# EasyEDA Pro project USB-HUB-V2.0.epro

# Schematic Schematic1
Board Name: Board1_1; Create Date: 2025-10-04; Page Name: P1; Project Name: USB扩展坞2.0; Schematic Name: Schematic1_1; Update Date: 2025-10-04; Company: 嘉立创EDA; Page Size: A4; Version: V1.0
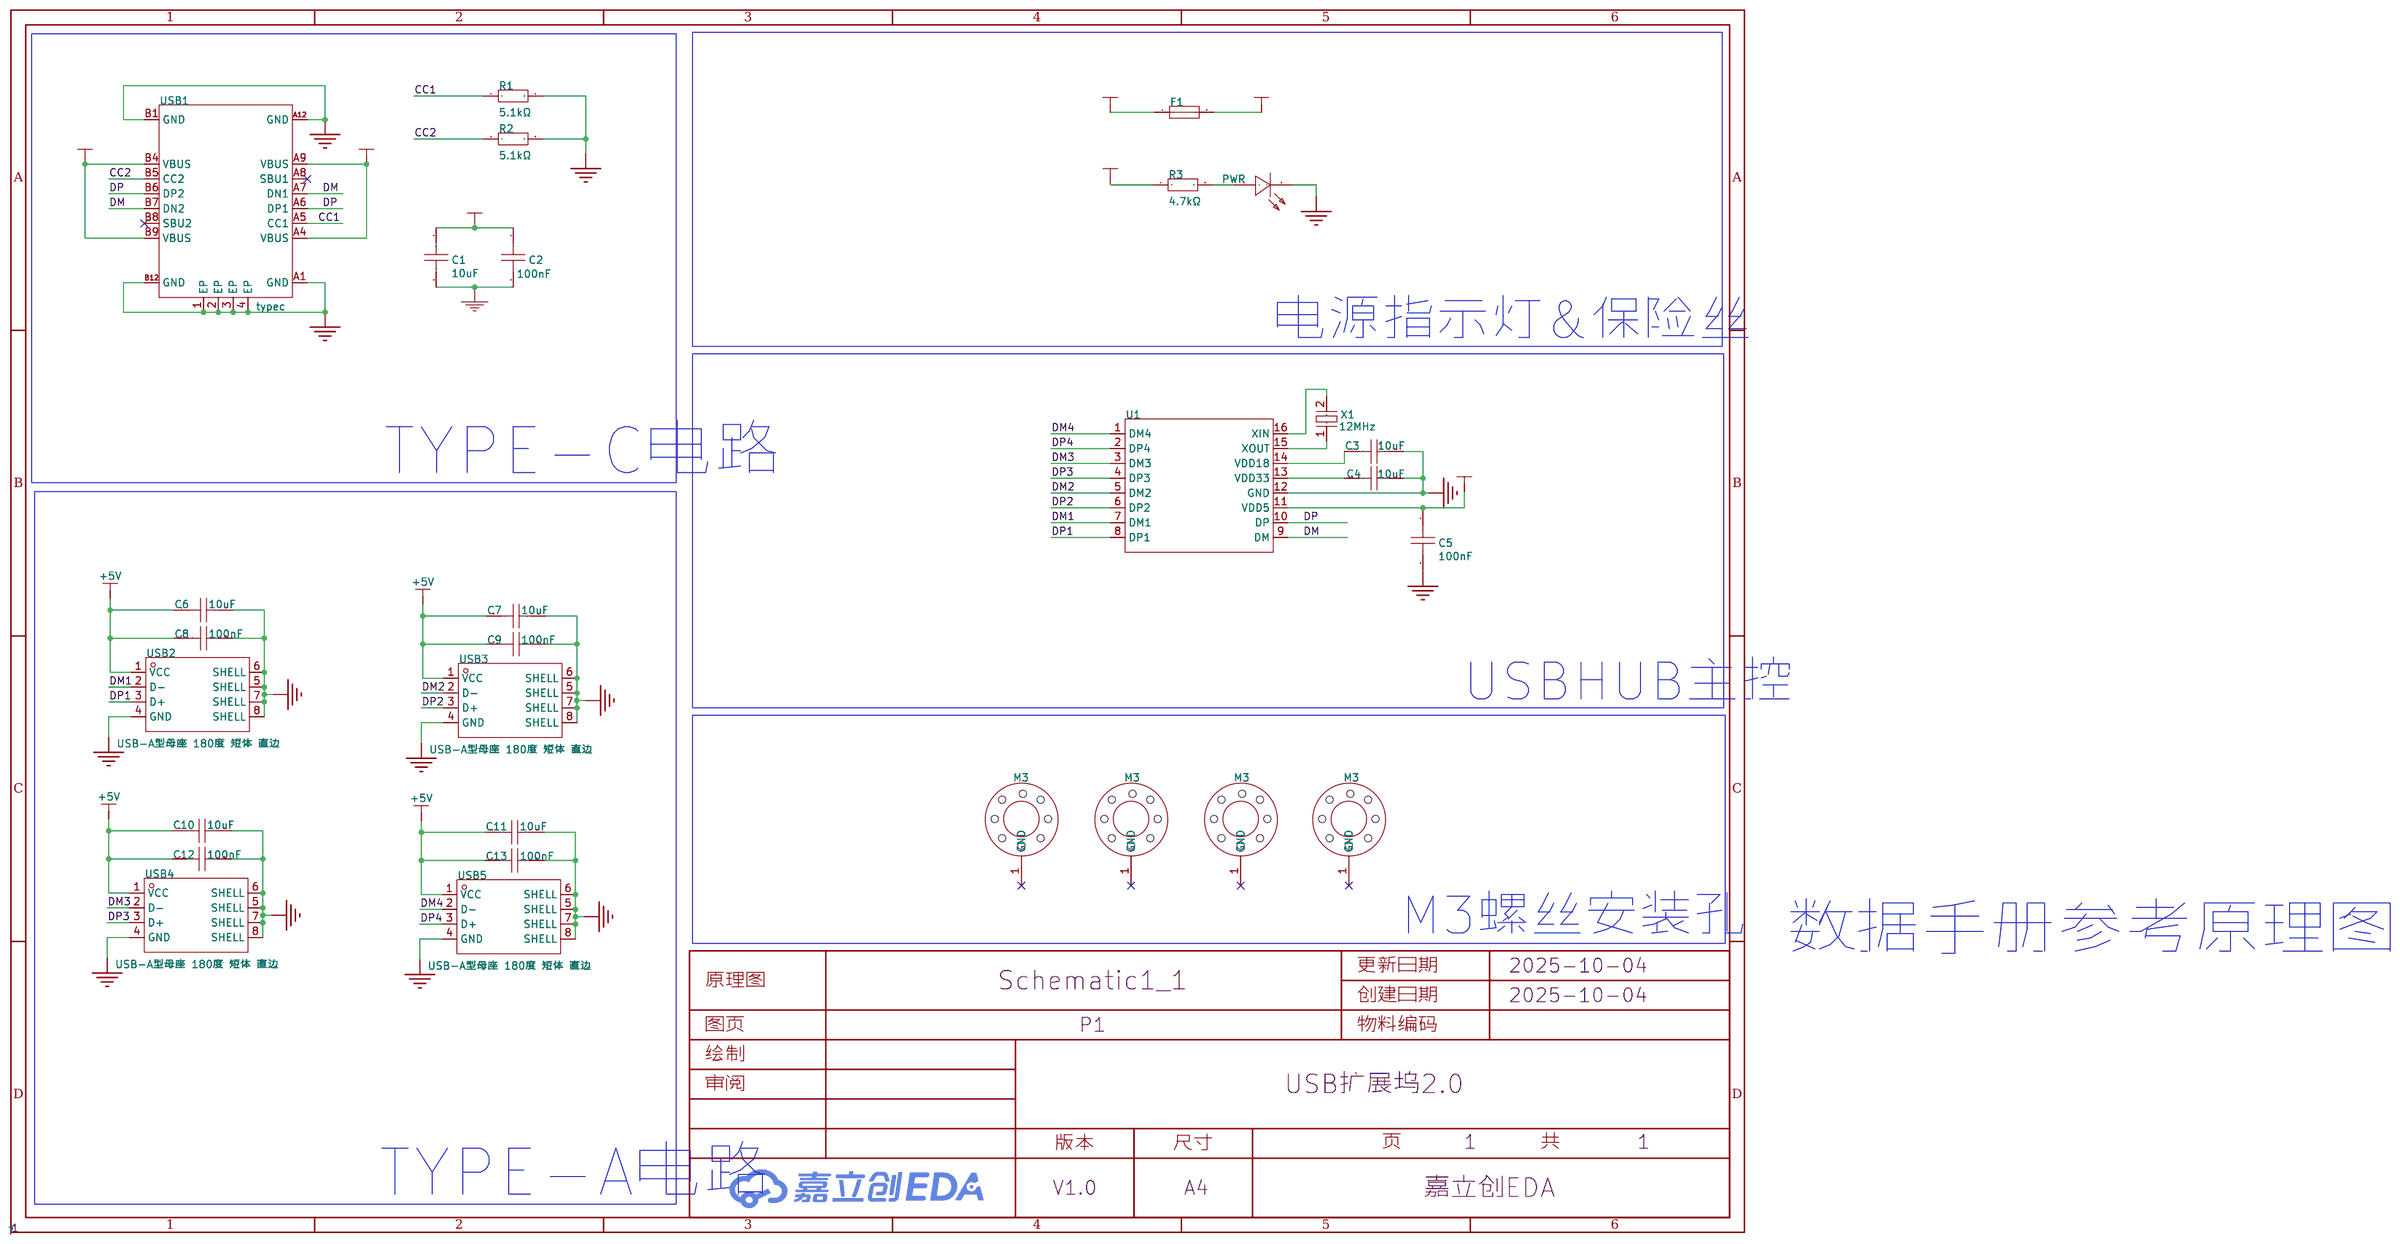
[diagram p0: schematic sheet]

## Parts
C1  10uF  [C0805]
C2  100nF  [C0805]
C3  10uF  [C0805]
C4  10uF  [C0805]
C5  100nF  [C0805]
C6  10uF  [C0805]
C7  10uF  [C0805]
C8  100nF  [C0805]
C9  100nF  [C0805]
C10  10uF  [C0805]
C11  10uF  [C0805]
C12  100nF  [C0805]
C13  100nF  [C0805]
F1  BSMD1206-150-12V  [F1206]
hole1  M3  [m3梅花孔]
hole2  M3  [m3梅花孔]
hole3  M3  [m3梅花孔]
hole4  M3  [m3梅花孔]
PWR  NCD0805R1  [LED0805-R-RD]
R1  5.1kΩ  [R0805]
R2  5.1kΩ  [R0805]
R3  4.7kΩ  [R0805]
U1  SL2.1A  [SOP-16_L10.0-W3.9-P1.27-LS6.0-BL]
USB1  typec  [USB-C-SMD_KH-TYPE-C-16P]
USB2  USB-A型母座 180度 短体 直边  [USB-A-SMD_WT_C9900004571]
USB3  USB-A型母座 180度 短体 直边  [USB-A-SMD_WT_C9900004571]
USB4  USB-A型母座 180度 短体 直边  [USB-A-SMD_WT_C9900004571]
USB5  USB-A型母座 180度 短体 直边  [USB-A-SMD_WT_C9900004571]
X1  12MHz  [CRYSTAL-SMD_L5.0-W3.2-1]

## Library data of the parts
C1 C6 C7 C10 C11 = CL21A106KOQNNNE: 容值:10uF;精度:±10%;额定电压:16V;温度系数:X5R;; LCSC Part Name: 10uF ±10% 16V; Supplier Part: C1713; Manufacturer: SAMSUNG(三星); Supplier Footprint: 0805; JLCPCB Part Class: Extended Part; Datasheet: https://item.szlcsc.com/datasheet/CL21A106KOQNNNE/2065.html; Supplier: LCSC; Tolerance: ±10%; Voltage Rating: 16V; Temperature Coefficient: X5R
C2 C5 C8 C9 C12 C13 = 0805B104K500NT: 容值:100nF;精度:±10%;额定电压:50V;温度系数:X7R;; LCSC Part Name: 100nF ±10% 50V; Supplier Part: C38141; Manufacturer: FH(风华); Supplier Footprint: 0805; JLCPCB Part Class: Extended Part; Datasheet: https://item.szlcsc.com/datasheet/0805B104K500NT/39123.html; Supplier: LCSC; Tolerance: ±10%; Voltage Rating: 50V; Temperature Coefficient: X7R
C3 C4 = CL21A106KBYQNNE: 容值:10uF;精度:±10%;额定电压:50V;温度系数:X5R;; LCSC Part Name: 10uF ±10% 50V; Supplier Part: C2932476; Manufacturer: SAMSUNG(三星); Supplier Footprint: 0805; JLCPCB Part Class: 扩展库; Datasheet: https://item.szlcsc.com/datasheet/CL21A106KBYQNNE/3277789.html; Supplier: LCSC; Tolerance: ±10%; Voltage Rating: 50V; Temperature Coefficient: X5R
F1 = BSMD1206-150-12V: 耐压(Vmax):12V;最大电流(Imax):40A;保持电流(Ihold):1.5A;跳闸电流(Itrip):3A;; LCSC Part Name: 12V 1.5A 1206自恢复; Supplier Part: C3020147; Manufacturer: BHFUSE(佰宏); Supplier Footprint: 1206; JLCPCB Part Class: 扩展库; Datasheet: https://item.szlcsc.com/datasheet/BSMD1206-150-12V/3539855.html; Supplier: LCSC; Voltage - Max: 12V; Current - Max: 40A; Hold Current: 1.5A; Trip Current: 3A; Power Dissipation: 800mW; Resistance - Initial (Ri) (Min): 25mΩ; Resistance - Post Trip (R1) (Max): 130mΩ; Operating Temperature: -40℃~+85℃
hole1-hole4 = m3_梅花螺丝孔: 梅花螺丝孔
PWR = NCD0805R1: 灯头类型:-;发光颜色:红色;正向电压(VF):1.6V~2.6V;功率:65mW;正向电流:20mA;主波长:615nm~630nm;二极管配置:独立二极管;透镜颜色:无色透明透镜;色温:-;发光强度:67mcd~195mcd;发光角度:130°;载带方式:-;工作温度:-30℃~+85℃;; Supplier Part: C84256; Manufacturer: 国星光电; Supplier Footprint: 0805; JLCPCB Part Class: 基础库; Datasheet: https://atta.szlcsc.com/upload/public/pdf/source/20200820/C84256_F0A75A43B3EAD75808600A0514C76B99.pdf; Supplier: LCSC; Emitted Color: 红色; Forward Voltage (VF): 1.6V~2.6V; Power Dissipation: 65mW; Forward Current: 20mA; Dominant Wavelength: 615nm~630nm; Diode Configuration: 独立二极管; Lens Color: 无色透明透镜; Luminous Intensity: 67mcd~195mcd; Viewing Angle: 130°; Operating Temperature: -30℃~+85℃
R1 R2 = 0805W8F5101T5E: 电阻类型:厚膜电阻;阻值:5.1kΩ;精度:±1%;功率:125mW;工作电压:150V;温度系数:±100ppm/℃;; LCSC Part Name: 5.1kΩ ±1% 125mW 厚膜电阻; Supplier Part: C27834; Manufacturer: UNI-ROYAL(厚声); Supplier Footprint: 0805; JLCPCB Part Class: 基础库; Datasheet: https://item.szlcsc.com/datasheet/0805W8F5101T5E/28584.html; Supplier: LCSC; Type: 厚膜电阻; Tolerance: ±1%; Power(Watts): 125mW; Voltage-Supply(Max): 150V; Temperature Coefficient: ±100ppm/℃; Operating Temperature: -55℃~+155℃
R3 = 0805W8F4701T5E: 电阻类型:厚膜电阻;阻值:4.7kΩ;精度:±1%;功率:125mW;最大工作电压:150V;温度系数:±100ppm/℃;; LCSC Part Name: 4.7kΩ ±1% 125mW 厚膜电阻; Supplier Part: C17673; Manufacturer: UNI-ROYAL(厚声); Supplier Footprint: 0805; JLCPCB Part Class: 基础库; Datasheet: https://atta.szlcsc.com/upload/public/pdf/source/20200306/C422600_1E6D84923E4A46A82E41ADD87F860B5C.pdf; Supplier: LCSC; Type: 厚膜电阻; Tolerance: ±1%; Power(Watts): 125mW; Overload Voltage (Max): 150V; Temperature Coefficient: ±100ppm/℃; Operating Temperature Range: -55℃~+155℃
U1 = SL2.1A: SL2.1A是一颗高集成度,高性能,低功耗的USB2.0集线器主控芯片，支持USB2.0高速(480MHz),全速(12MHz)和低速模式(1.5MHz)，内置12MHz晶体振荡器。; LCSC Part Name: USB2.0高速4端口HUB控制器; Supplier Part: C192893; Manufacturer: CoreChips(和芯润德); Supplier Footprint: SOP-16; JLCPCB Part Class: Extended Part; Datasheet: https://atta.szlcsc.com/upload/public/pdf/source/20180522/C192893_624110D24898D57AAC785E3DF98EA862.pdf; Supplier: LCSC
USB1 = typec: Supplier Part: C9900016956; Supplier Footprint: typec 12p; JLCPCB Part Class: 扩展库; Supplier: LCSC
USB2-USB5 = USB-A型母座 180度 短体 直边: Supplier Part: C9900004571; Supplier Footprint: SMD; JLCPCB Part Class: 扩展库; Supplier: LCSC
X1 = HY12MSMD5032TCOB1R10: 频率:12MHz;负载电容:20pF;频率稳定度:±10ppm;; LCSC Part Name: 12MHz 20pF; Supplier Part: C7275156; Manufacturer: Huiyuan crystal(惠源晶工); Supplier Footprint: SMD5032-2P; JLCPCB Part Class: 扩展库; Datasheet: https://item.szlcsc.com/datasheet/HY12MSMD5032TCOB1R10/8244163.html; Supplier: LCSC; Load Capacitance: 20pF; Frequency Stability: ±10ppm; Equivalent Series Resistance(ESR): 50Ω

## Nets
+5V: C5.1 C6.1 C7.1 C8.1 C9.1 C10.1 C11.1 C12.1 C13.1 F1.2 R3.1 U1.11(VDD5) USB2.1(VCC) USB3.1(VCC) USB4.1(VCC) USB5.1(VCC)
GND: C1.2 C2.2 C3.2 C4.2 C5.2 C6.2 C7.2 C8.2 C9.2 C10.2 C11.2 C12.2 C13.2 PWR.2(-) R1.2 R2.2 U1.12(GND) USB1.1(EP) USB1.2(EP) USB1.3(EP) USB1.4(EP) USB1.A1(GND) USB1.A12(GND) USB1.B1(GND) USB1.B12(GND) USB2.4(GND) USB2.5(SHELL) USB2.6(SHELL) USB2.7(SHELL) USB2.8(SHELL) USB3.4(GND) USB3.5(SHELL) USB3.6(SHELL) USB3.7(SHELL) USB3.8(SHELL) USB4.4(GND) USB4.5(SHELL) USB4.6(SHELL) USB4.7(SHELL) USB4.8(SHELL) USB5.4(GND) USB5.5(SHELL) USB5.6(SHELL) USB5.7(SHELL) USB5.8(SHELL)
VBUS: C1.1 C2.1 F1.1 USB1.A4(VBUS) USB1.A9(VBUS) USB1.B4(VBUS) USB1.B9(VBUS)
CC1: R1.1 USB1.A5(CC1)
CC2: R2.1 USB1.B5(CC2)
DM: U1.9(DM) USB1.A7(DN1) USB1.B7(DN2)
DM1: U1.7(DM1) USB2.2(D-)
DM2: U1.5(DM2) USB3.2(D-)
DM3: U1.3(DM3) USB4.2(D-)
DM4: U1.1(DM4) USB5.2(D-)
DP: U1.10(DP) USB1.A6(DP1) USB1.B6(DP2)
DP1: U1.8(DP1) USB2.3(D+)
DP2: U1.6(DP2) USB3.3(D+)
DP3: U1.4(DP3) USB4.3(D+)
DP4: U1.2(DP4) USB5.3(D+)
$1N2176: C4.1 U1.13(VDD33)
$1N2182: C3.1 U1.14(VDD18)
$1N5507: U1.16(XIN) X1.2(GND)
$1N5514: U1.15(XOUT) X1.1
$1N7940: PWR.1(+) R3.2

Not connected (* = marked no-connect by the designer): hole1 1(GND)*; hole2 1(GND)*; hole3 1(GND)*; hole4 1(GND)*; USB1 A8(SBU1)* B8(SBU2)*

## Notes on the sheet
- 电源指示灯&保险丝
- TYPE-C电路
- USBHUB主控
- M3螺丝安装孔
- 数据手册参考原理图
- TYPE-A电路

# Board PCB1
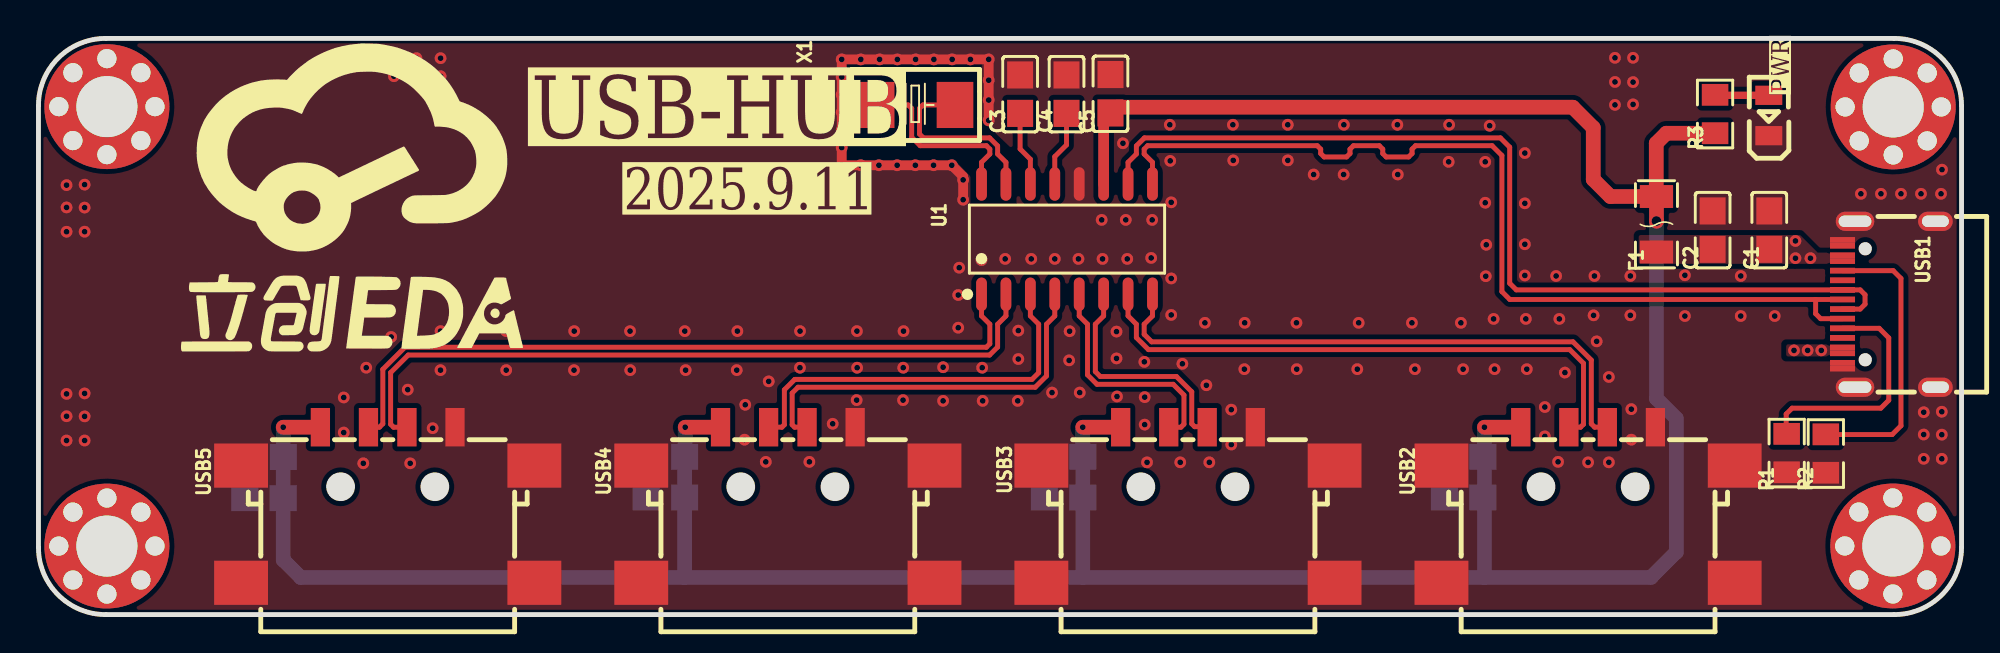
[diagram p1: board, top side]
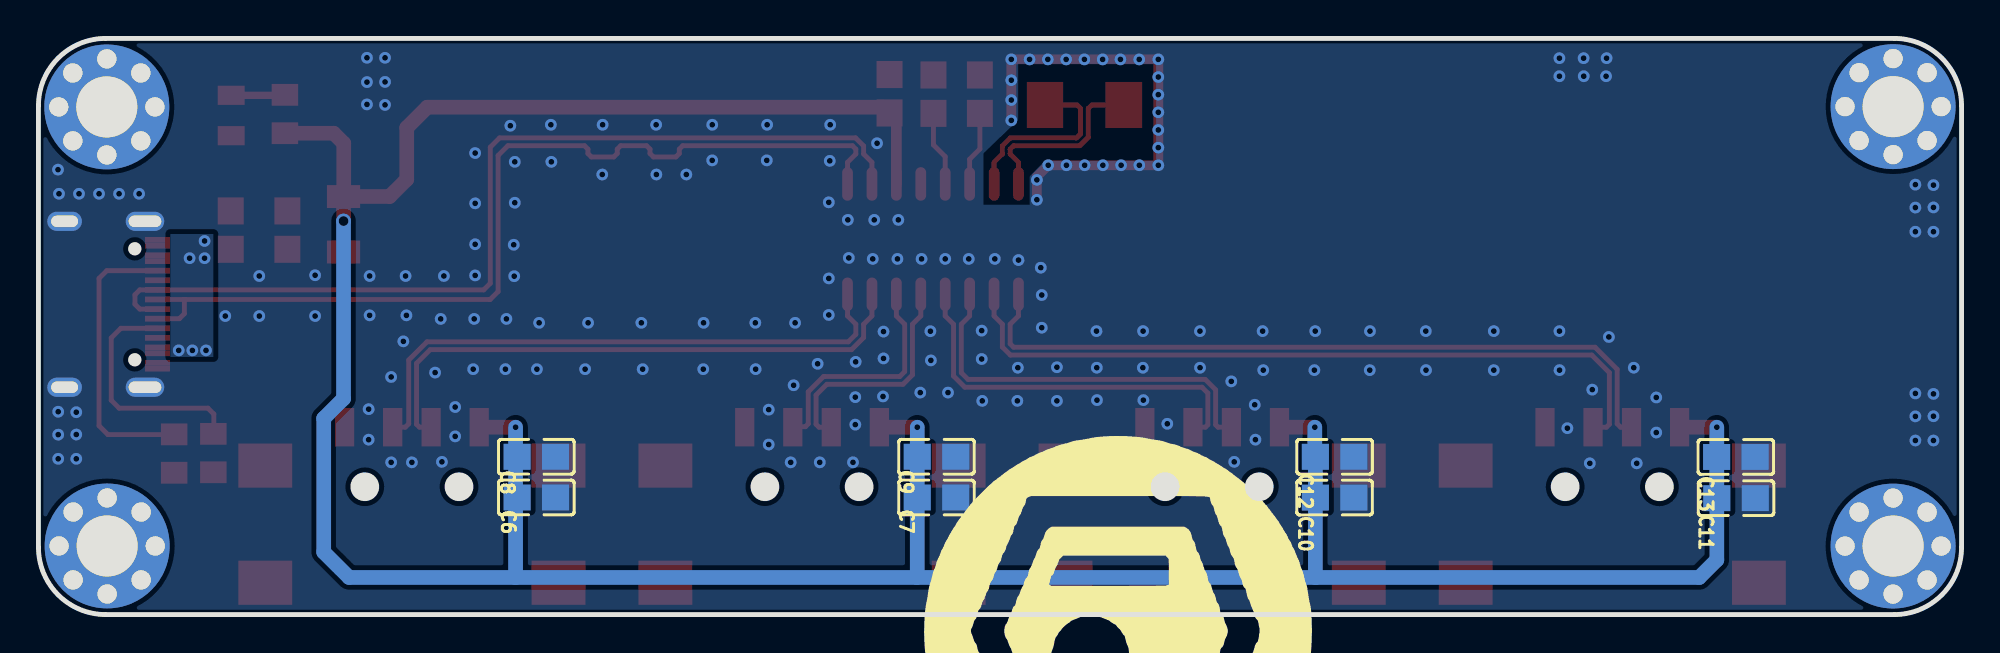
[diagram p2: board, bottom side, seen from below]

Outline 100 x 30 mm; copper layers: Top Layer, Bottom Layer. Coordinates in mm from the lower left corner of the outline.
Outline path: 0,26.5 0,3.5 arc(1.03,1.03) 3.5,0 96.5,0 arc(98.97,1.03) 100,3.5 100,26.5 arc(98.97,28.97) 96.5,30 3.5,30 arc(1.03,28.97) 0,26.5
Stack: Top Layer 0.035mm / Dielectric1 1.51mm FR4 er 4.5 / Bottom Layer 0.035mm

## Design rules (mm)
net DM4: DP5
net DP4: DP5
net DM3: DP4
net DP3: DP4
net DM2: DP2
net DP2: DP2
net DM1: DP3
net DP1: DP3
net $1N5507: DP1
net $1N5514: DP1
net DP: DP6
net DM: DP6
template: 自定义配置
spacing copperThickness1oz (default): track to track 0.102, other pairs 0.152 to 0.3
spacing copperThickness2oz: track to track 0.203, other pairs 0.152 to 0.3
track width copperThickness1oz (default): min 0.127, default 0.254, max 2.54
track width copperThickness2oz: min 0.203, default 0.254, max 2.54
differential pair differentialPair (default): width min 0.127, default 0.254, max 2.54; gap min 0.152, default 0.152
via viaSize (default): diameter min 0.5, default 0.61, max 10; hole min 0.3, default 0.305, max 6.3

## Placement (name value [footprint] x y rotation side)
C1  10uF  [C0805]  90 20.02 90 top
C2  100nF  [C0805]  87.06 20.02 90 top
C3  10uF  [C0805]  51.05 27.1 90 top
C4  10uF  [C0805]  53.46 27.1 90 top
C5  100nF  [C0805]  55.74 27.12 90 top
C6  10uF  [C0805]  74.11 6.1 180 bottom
C7  10uF  [C0805]  53.3 6.1 180 bottom
C8  100nF  [C0805]  74.11 8.22 180 bottom
C9  100nF  [C0805]  53.3 8.22 180 bottom
C10  10uF  [C0805]  32.6 6.09 180 bottom
C11  10uF  [C0805]  11.73 6.06 180 bottom
C12  100nF  [C0805]  32.6 8.22 180 bottom
C13  100nF  [C0805]  11.73 8.21 180 bottom
F1  BSMD1206-150-12V  [F1206]  84.14 20.32 90 top
hole1  M3  [m3梅花孔]  3.56 26.45 270 top
hole2  M3  [m3梅花孔]  96.45 26.43 270 top
hole3  M3  [m3梅花孔]  96.43 3.57 270 top
hole4  M3  [m3梅花孔]  3.56 3.57 270 top
PWR  NCD0805R1  [LED0805-R-RD]  89.98 25.99 90 top
R1  5.1kΩ  [R0805]  90.91 8.41 270 top
R2  5.1kΩ  [R0805]  92.94 8.38 270 top
R3  4.7kΩ  [R0805]  87.18 26.06 90 top
U1  SL2.1A  [SOP-16_L10.0-W3.9-P1.27-LS6.0-BL]  53.48 19.55 0 top
USB1  typec  [USB-C-SMD_KH-TYPE-C-16P]  96.23 16.16 90 top
USB2  USB-A型母座 180度 短体 直边  [USB-A-SMD_WT_C9900004571]  80.58 5.71 0 top
USB3  USB-A型母座 180度 短体 直边  [USB-A-SMD_WT_C9900004571]  59.77 5.71 0 top
USB4  USB-A型母座 180度 短体 直边  [USB-A-SMD_WT_C9900004571]  38.97 5.71 0 top
USB5  USB-A型母座 180度 短体 直边  [USB-A-SMD_WT_C9900004571]  18.16 5.71 0 top
X1  12MHz  [CRYSTAL-SMD_L5.0-W3.2-1]  45.61 26.53 180 top

## Footprints (pads in the part's own frame, mm; a bottom-side part is the same pattern mirrored in y, then rotated)
C0805
  rect 1.41x1.35 smd: 1(-1,0) 2(1,0)
CRYSTAL-SMD_L5.0-W3.2-1
  rect 1.9x2.4 smd: 1(-2.05,0) 2(2.05,0)
F1206
  rect 1.19x1.728 smd: 1(-1.445,0) 2(1.445,0)
LED0805-R-RD
  rect 1x1.399 smd: 1(1.05,0) 2(-1.05,0)
m3梅花孔
  round 1 hole 1: 1(-2.5,0) 1(-1.768,1.768) 1(-1.768,-1.768) 1(0,2.5) 1(0,-2.5) 1(1.768,1.768) 1(1.768,-1.768) 1(2.5,0)
  round 6.5 hole 3.18x3.175: 1(0,0)
R0805
  rect 1.133x1.377 smd: 1(-1,0) 2(1,0)
SOP-16_L10.0-W3.9-P1.27-LS6.0-BL
  oval 0.56x1.745 smd: 1(-4.445,-2.873) 2(-3.175,-2.873) 3(-1.905,-2.873) 4(-0.635,-2.873) 5(0.635,-2.873) 6(1.905,-2.873) 7(3.175,-2.873) 8(4.445,-2.873) 9(4.445,2.873) 10(3.175,2.873) 11(1.905,2.873) 12(0.635,2.873) 13(-0.635,2.873) 14(-1.905,2.873) 15(-3.175,2.873) 16(-4.445,2.873)
USB-A-SMD_WT_C9900004571
  rect 1x2 smd: 1(-3.5,4.05) 2(-1,4.05) 3(1,4.05) 4(3.5,4.05)
  rect 2.8x2.3 smd: 5(-7.625,2.05) 6(-7.625,-4.05) 7(7.625,-4.05) 8(7.625,2.05)
USB-C-SMD_KH-TYPE-C-16P
  oval 1x2 hole 0.6x1.7: 1(-4.32,1.765) 2(4.32,1.765)
  oval 1x1.8 hole 0.6x1.4: 3(-4.32,-2.415) 4(4.32,-2.415)
  rect 0.3x1.3 smd: A1(-3.35,2.415) A4(-2.55,2.415) A5(-1.25,2.415) A6(-0.25,2.415) A7(0.25,2.415) A8(1.25,2.415) A9(2.55,2.415) A12(3.35,2.415) B1(3.05,2.415) B4(2.25,2.415) B5(1.75,2.415) B6(0.75,2.415) B7(-0.75,2.415) B8(-1.75,2.415) B9(-2.25,2.415) B12(-3.05,2.415)

## Nets
As in the schematic.

Pads without a net: hole1 1; hole2 1; hole3 1; hole4 1; USB1 A8 B8

## Via types
v1: diameter 0.61, hole 0.305, Top Layer to Bottom Layer, 206 vias
v2: diameter 0.762, hole 0.508, Top Layer to Bottom Layer, 1 via

## Routing (per net, layer and track width the routed paths; a pad name or vN(x,y) marks a point on that pad's centre or on a via; arc(x,y) is an arc through that point)
+5V: length 172.2
  Top Layer w0.559: U1.11 55.39,25.83 55.63,26.07 ; 55.63,26.12 C5.1
  Top Layer w0.762: C5.1 56.04,26.42 79.78,26.42 80.85,25.35 80.85,22.66 81.74,21.77 84,21.77 ; v2(84.14,20.49) F1.2 84.12,21.76 84.12,24.54 84.65,25.06 R3.1 ; v1(12.73,9.76) 14.66,9.76 ; v1(33.63,9.76) 35.47,9.76 ; v1(54.3,9.76) 56.27,9.76 ; v1(75.19,9.76) 77.08,9.76
  Bottom Layer w0.762: v1(12.73,9.76) C11.1 12.73,2.85 13.64,1.93 33.59,1.93 ; 54.32,1.93 33.59,1.93 ; 54.32,1.93 54.3,1.95 C7.1 C9.1 v1(54.3,9.76) ; 54.32,1.93 83.85,1.93 85.17,3.25 85.17,10.21 84.14,11.24 v2(84.14,20.49) ; 33.59,1.93 33.6,1.95 C10.1 C12.1 33.63,8.24 v1(33.63,9.76) ; v1(75.19,9.76) 75.19,1.93
GND: length 24.1
  Top Layer w0.508: v1(48.08,21.6) 48.08,22.81 v1(47.49,23.4) v1(46.55,23.4) v1(45.6,23.4) v1(44.65,23.4) v1(43.7,23.4) v1(42.76,23.4) v1(41.77,23.4) v1(41.77,24.31) v1(41.77,25.23) v1(41.77,26.15) v1(41.77,27.07) v1(41.77,27.99) v1(41.77,28.91) ; 41.77,28.91 v1(49.41,28.91) v1(49.41,27.82) v1(49.41,26.79) v1(49.41,25.73)
  vias: v1(1.46,22.36) v1(1.46,21.2) v1(1.46,19.93) v1(1.46,11.49) v1(1.46,10.33) v1(1.46,9.06) v1(2.4,22.39) v1(2.4,21.19) v1(2.4,19.94) v1(2.4,11.52) v1(2.4,10.32) v1(2.4,9.06) v1(15.88,11.31) v1(15.88,9.48) v1(16.89,7.88) v1(17.04,12.85) v1(18.34,14.45) v1(18.46,28.97) v1(18.48,28.03) v1(19.2,11.71) v1(19.33,7.88) v1(19.65,28.97) v1(19.65,28.03) v1(20.5,9.71) v1(20.91,28.97) v1(20.91,28.03) v1(20.91,14.76) v1(20.9,12.73) v1(24.32,14.76) v1(24.32,12.73) v1(27.86,14.76) v1(27.85,12.73) v1(30.76,14.76) v1(30.77,12.73) v1(33.61,14.76) v1(33.65,12.73) v1(36.34,14.76) v1(36.31,12.73) v1(36.75,10.92) v1(36.72,9.11) v1(37.82,7.95) v1(37.97,12.14) v1(39.6,14.76) v1(39.6,12.85) v1(40.09,7.95) v1(41.3,9.93) v1(42.56,14.76) v1(42.57,12.85) v1(42.55,11.17) v1(42.76,28.91) v1(43.74,28.91) v1(44.66,28.91) v1(44.98,14.76) v1(44.97,12.85) v1(44.96,11.17) v1(45.61,28.91) v1(46.56,28.91) v1(47.04,12.88) v1(47.04,11.13) v1(47.51,28.91) v1(47.88,18.06) v1(47.83,16.64) v1(47.83,14.94) v1(48.08,22.63) v1(48.46,28.91) v1(49.04,18.46) v1(49.07,12.85) v1(49.1,11.13) v1(50.27,18.52) v1(50.95,14.79) v1(50.95,13.31) v1(50.92,11.13) v1(51.63,18.52) v1(52.7,11.56) v1(52.85,18.52) v1(53.59,13.24) v1(53.62,14.75) v1(54.08,18.52) v1(54.15,11.56) v1(55.29,20.55) v1(55.33,18.52) v1(56.06,14.73) v1(56.06,13.34) v1(56.08,11.36) v1(56.39,24.54) v1(56.54,20.55) v1(56.62,18.52) v1(57.51,13.16) v1(57.52,11.32) v1(57.52,9.89) v1(57.64,7.93) v1(57.86,18.57) v1(57.91,20.55) v1(58.83,25.5) v1(58.85,23.62) v1(58.9,21.47) v1(58.9,17.5) v1(58.9,15.6) v1(59.37,7.93) v1(59.48,13.06) v1(60.66,15.19) v1(60.73,11.94) v1(60.88,7.93) v1(62.03,10.67) v1(62.03,8.85) v1(62.11,25.5) v1(62.13,23.65) v1(62.72,15.19) v1(62.71,12.78) v1(64.96,25.5) v1(64.97,23.65) v1(65.42,15.19) v1(65.43,12.78) v1(66.31,22.91) v1(67.88,25.5) v1(67.87,22.91) v1(68.58,12.78) v1(68.65,15.19) v1(70.66,25.5) v1(70.68,22.91) v1(71.42,15.19) v1(71.58,12.78) v1(73.36,25.5) v1(73.33,23.57) v1(73.97,15.19) v1(74.08,12.78) v1(75.23,23.57) v1(75.23,21.44) v1(75.29,19.26) v1(75.26,17.62) v1(75.46,25.45) v1(75.67,15.39) v1(75.72,12.78) v1(77.29,24.03) v1(77.29,21.41) v1(77.29,19.28) v1(77.29,17.66) v1(77.34,15.39) v1(77.39,12.78) v1(78.33,10.81) v1(78.33,9.28) v1(78.92,17.63) v1(79.08,15.39) v1(79.02,7.95) v1(79.37,12.6) v1(80.58,7.93) v1(80.87,15.58) v1(80.91,17.63) v1(81.03,14.23) v1(81.66,12.37) v1(81.66,7.93) v1(81.98,28.99) v1(81.98,27.73) v1(81.98,26.54) v1(82.78,17.63) v1(82.78,15.58) v1(82.83,10.7) v1(82.83,9.11) v1(82.92,28.99) v1(82.92,27.73) v1(82.92,26.56) v1(85.61,17.67) v1(85.61,15.54) v1(88.52,17.63) v1(88.52,15.54) v1(90.29,15.54) v1(94.77,21.91) v1(95.81,21.91) v1(96.85,21.91) v1(97.89,21.91) v1(98.03,10.54) v1(98.03,9.38) v1(98.03,8.11) v1(98.98,23.17) v1(98.93,21.91) v1(98.97,10.56) v1(98.97,9.37) v1(98.97,8.11)
VBUS:
  vias: v1(91.29,13.76) v1(91.36,19.45) v1(91.36,18.56) v1(92,13.76) v1(92.14,18.56) v1(92.71,13.76)
CC1: length 12.5
  Top Layer w0.254: USB1.A5 95.71,14.91 96.22,14.41 96.22,11.16 95.8,10.75 91.19,10.75 90.88,10.44 90.88,9.44 R1.1
CC2: length 14.7
  Top Layer w0.254: 93.27,9.38 93.28,9.37 96.39,9.37 96.85,9.83 96.85,17.5 96.45,17.91 USB1.B5
DM: length 49.5
  Top Layer w0.254: 92.41,16.41 92.41,15.67 92.67,15.41 93.79,15.41 ; 92.41,16.41 76.51,16.41 76.1,16.82 76.1,23.9 75.59,24.41 71.61,24.41 71.43,24.23 71.43,24.01 71.25,23.83 70.08,23.83 69.9,24.01 69.9,24.23 69.72,24.41 68.38,24.41 68.2,24.23 68.2,24.01 68.02,23.83 66.86,23.83 66.68,24.01 66.68,24.23 66.5,24.41 57.68,24.41 57.5,24.23 57.5,23.98 57.93,23.55 U1.9 ; 92.41,16.41 93.79,16.41
DM1: length 30.2
  Top Layer w0.254: U1.7 56.66,15.55 57.09,15.12 57.09,14.42 57.72,13.79 79.63,13.79 80.34,13.08 80.34,9.91 80.19,9.76 USB2.2
DM2: length 12.2
  Top Layer w0.254: U1.5 54.12,15.55 54.55,15.12 54.55,12.48 55.04,11.99 59,11.99 59.56,11.43 59.56,9.91 59.41,9.76 58.77,9.76
DM3: length 20.5
  Top Layer w0.254: U1.3 51.58,15.55 52.01,15.12 52.01,12.59 51.66,12.25 39.33,12.25 38.79,11.7 38.79,9.88 38.66,9.76 USB4.2
DM4: length 38.5
  Top Layer w0.254: U1.1 49.04,15.55 49.47,15.12 49.47,14.1 49.29,13.92 19.06,13.92 17.91,12.77 17.91,9.93 17.73,9.76 USB5.2
DP: length 49.6
  Top Layer w0.254: 93.79,15.91 94.73,15.91 94.98,16.16 94.98,16.65 94.73,16.91 USB1.B6 76.85,16.91 76.5,17.25 76.5,24.34 76.02,24.82 57.51,24.82 57.09,24.4 57.09,23.98 56.66,23.55 U1.10
DP1: length 30.3
  Top Layer w0.254: U1.8 57.93,15.55 57.5,15.12 57.5,14.59 57.89,14.2 79.8,14.2 80.75,13.25 80.75,9.93 80.92,9.76 USB2.3
DP2: length 12.2
  Top Layer w0.254: USB3.3 60.77,9.78 60.12,9.78 59.97,9.93 59.97,11.6 59.17,12.4 55.21,12.4 54.96,12.65 54.96,15.12 55.39,15.55 U1.6
DP3: length 20.5
  Top Layer w0.254: USB4.3 39.32,9.76 39.19,9.88 39.19,11.53 39.5,11.84 51.83,11.84 52.42,12.42 52.42,15.12 52.85,15.55 U1.4
DP4: length 38.6
  Top Layer w0.254: 19.16,9.76 18.47,9.76 18.31,9.91 18.31,12.6 19.23,13.51 49.46,13.51 49.88,13.93 49.88,15.12 50.31,15.55 U1.2
$1N2176: length 3.9
  Top Layer w0.254: C4.1 53.46,24.45 52.85,23.84 U1.13
$1N2182: length 3.9
  Top Layer w0.254: U1.14 51.58,23.71 51.05,24.24 C3.1
$1N5507: length 9.7
  Top Layer w0.254: X1.2 45.23,26.53 45.41,26.35 45.41,24.86 45.85,24.41 49.29,24.41 49.47,24.23 49.47,23.98 49.04,23.55 U1.16
$1N5514: length 9.7
  Top Layer w0.254: U1.15 50.31,23.55 49.88,23.98 49.88,24.4 49.46,24.82 46.02,24.82 45.81,25.02 45.81,26.35 45.99,26.53 X1.1
$1N7940: length 2.8
  Top Layer w0.381: R3.2 87.21,27.04 PWR.1

## Copper pours and planes (outline as drawn; the poured copper is in the pictures)
GND on Top Layer: 104.9,33 104.9,-7.16 -3.63,-7.16 -3.63,33
GND on Bottom Layer: 107.39,36.93 107.39,-9.4 -6.73,-9.4 -6.73,36.93
VBUS on Top Layer: 94.46,18.86 94.46,18.26 83.21,18.26 83.21,19.74 83.24,19.76 91.6,19.76 92.52,18.85 94.45,18.85
VBUS on Top Layer: 94.34,14.07 94.34,13.44 90.88,13.44 90.88,14.07
VBUS on Bottom Layer: 90.91,19.81 93.14,19.81 93.14,13.41 90.91,13.41

## Text on the board
Top Silkscreen Layer: 2025.9.11 | USB-HUB
